# EAGLE design Regbot (EAGLE 9.2.0)
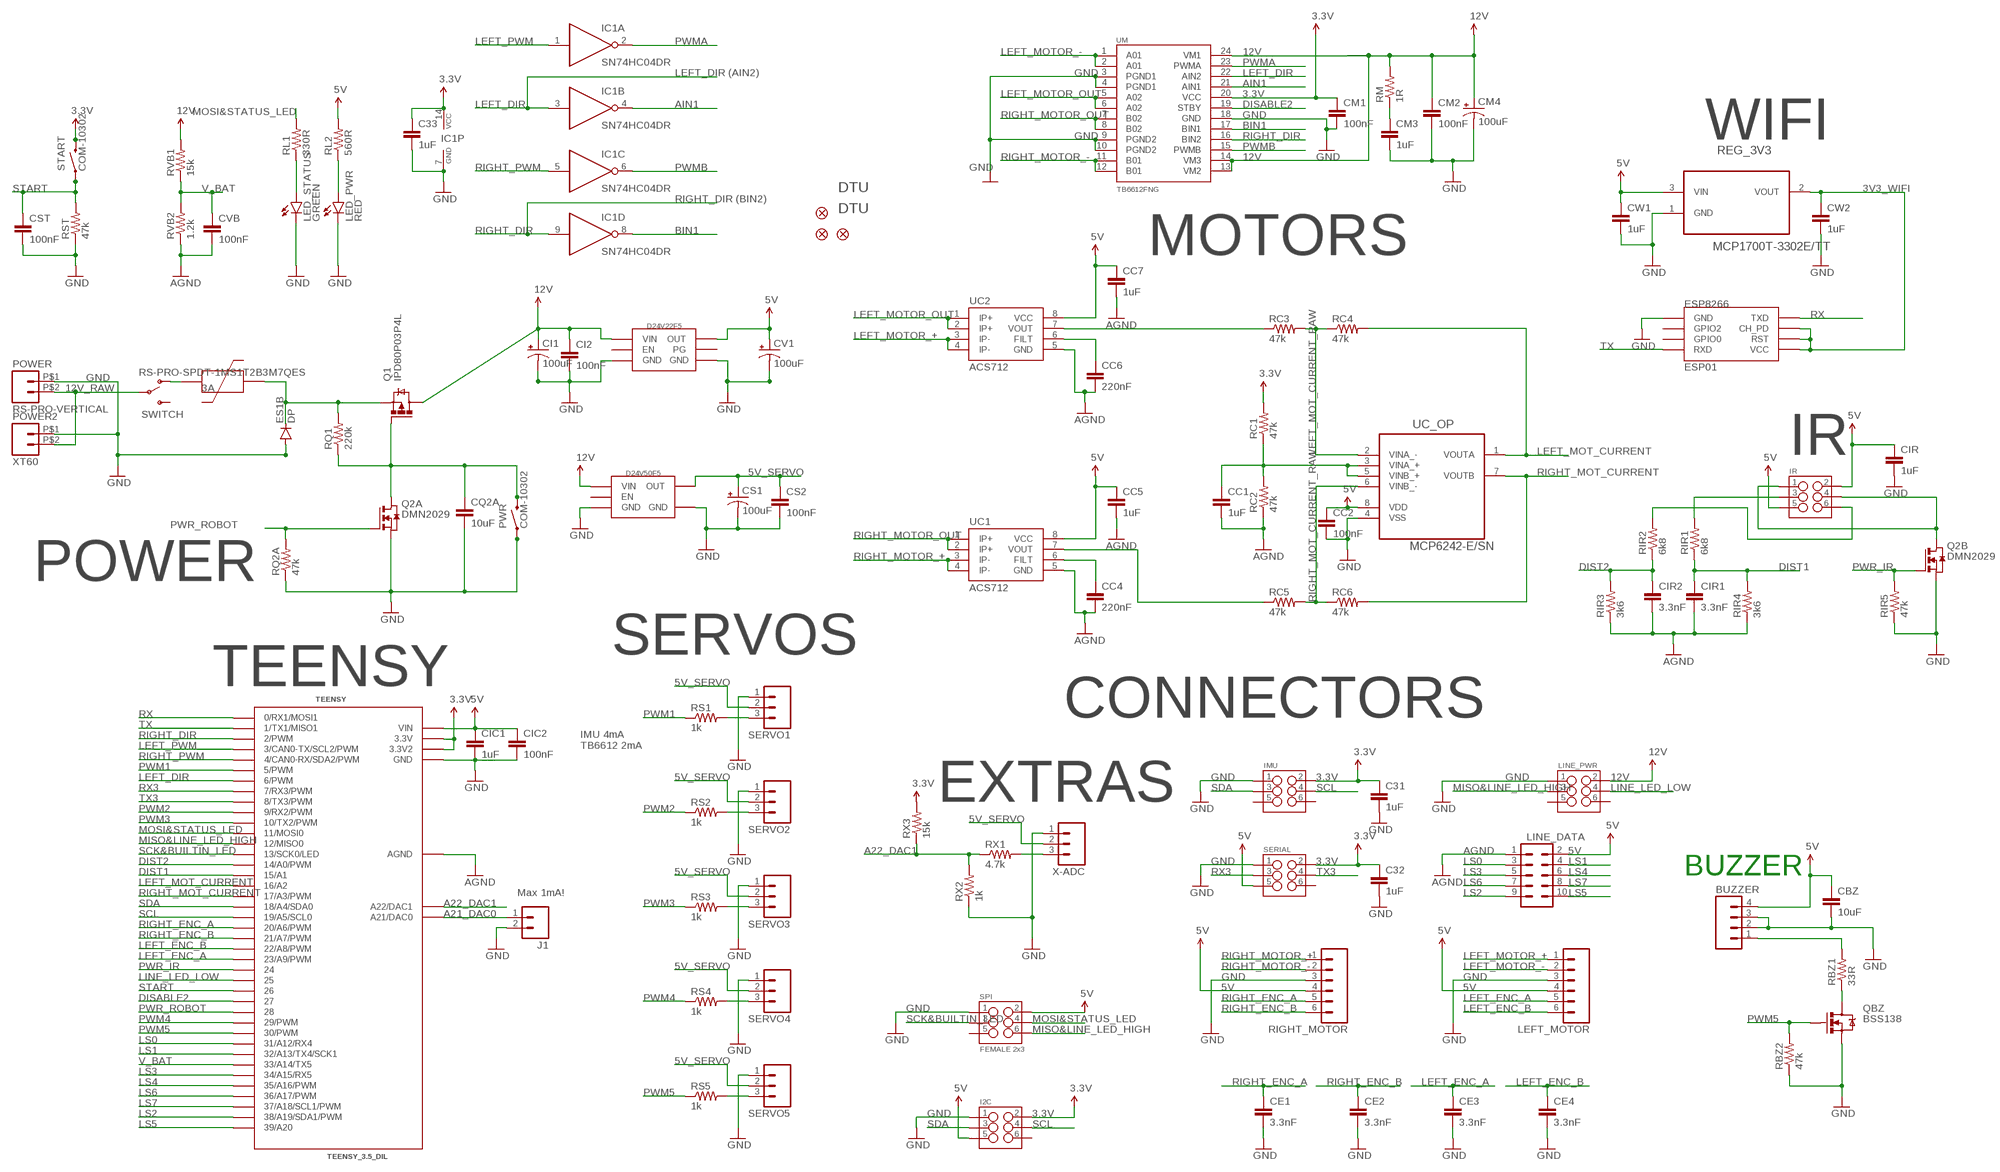
[diagram p0: schematic, sheet 1]

## Parts
BUZZER  M04POLAR  [MOLEX-1X4]
C31  1uF  CAP0805  [0805]
C32  1uF  CAP0805  [0805]
C33  1uF  CAP0805  [0805]
CBZ  10uF  CAP1210  [1210]
CC1  1uF  CAP0805  [0805]
CC2  100nF  CAP0805  [0805]
CC4  220nF  CAP0805  [0805]
CC5  1uF  CAP0805  [0805]
CC6  220nF  CAP0805  [0805]
CC7  1uF  CAP0805  [0805]
CE1  3.3nF  CAP0805  [0805]
CE2  3.3nF  CAP0805  [0805]
CE3  3.3nF  CAP0805  [0805]
CE4  3.3nF  CAP0805  [0805]
CI1  100uF  PANASONIC_D  [PANASONIC_D_XL]
CI2  100nF  CAP0805  [0805]
CIC1  1uF  CAP0805  [0805]
CIC2  100nF  CAP0805  [0805]
CIR  1uF  CAP0805  [0805]
CIR1  3.3nF  CAP0805  [0805]
CIR2  3.3nF  CAP0805  [0805]
CM1  100nF  CAP0805  [0805]
CM2  100nF  CAP0805  [0805]
CM3  1uF  CAP0805  [0805]
CM4  100uF  PANASONIC_D  [PANASONIC_D_XL]
CQ2A  10uF  CAP1210  [1210]
CS1  100uF  PANASONIC_D  [PANASONIC_D_XL]
CS2  100nF  CAP0805  [0805]
CST  100nF  CAP0805  [0805]
CV1  100uF  PANASONIC_D  [PANASONIC_D_XL]
CVB  100nF  CAP0805  [0805]
CW1  1uF  CAP0805  [0805]
CW2  1uF  CAP0805  [0805]
D24V22F5  POLOLU_D24V22  [D24V22]
D24V50F5  POLOLU_D24V50  [D24V50]
DP  ES1B  DIODESMA  [SMA-DIODE]
ESP8266  ESP01  [ESP01]
FD1  FIDUCIAL1X2  [FIDUCIAL-1X2]
FD2  FIDUCIAL1X2  [FIDUCIAL-1X2]
FD3  FIDUCIAL1X2  [FIDUCIAL-1X2]
I2C  M03X2SHROUD  [2X3-SHROUDED]
IC1  SN74HC04DR  74HC04D  [SO14]
IMU  M03X2SHROUD  [2X3-SHROUDED]
IR  M03X2SHROUD  [2X3-SHROUDED]
J1  M02PTH  [1X02]
LED_PWR  RED  LED1206  [LED-1206]
LED_STATUS  GREEN  LED1206  [LED-1206]
LEFT_MOTOR  M06SILK_FEMALE_PTH  [1X06]
LINE_DATA  M05X2SHD  [2X5-SHROUDED]
LINE_PWR  M03X2SHROUD  [2X3-SHROUDED]
MAIN_FUSE  SMF_OMNI-BLOK_FUSE_BLOCK  [SMF_OMNI-BLOK_FUSE_BLOCK]
POWER  RS-PRO-VERTICAL  [RS-PRO-VERTICAL]
POWER2  XT60  [XT60]
PWR  COM-10302  SWITCH-MOMENTARY  [TACTILE-PTH-12MM]
Q1  IPD80P03P4L  IRFR5305  [D-PAK_TO252AA]
Q2  DMN2029  NMOS2SO8  [SO8]
QBZ  BSS138  MOSFET-NCHANNELBSS138  [SOT23]
RBZ1  33R  RESISTOR0805-RES  [0805]
RBZ2  47k  RESISTOR0805-RES  [0805]
RC1  47k  RESISTOR0805-RES  [0805]
RC2  47k  RESISTOR0805-RES  [0805]
RC3  47k  RESISTOR0805-RES  [0805]
RC4  47k  RESISTOR0805-RES  [0805]
RC5  47k  RESISTOR0805-RES  [0805]
RC6  47k  RESISTOR0805-RES  [0805]
REG_3V3  MCP1700T-3302E/TT  [SOT95P237X112-3N]
RIGHT_MOTOR  M06SILK_FEMALE_PTH  [1X06]
RIR1  6k8  RESISTOR0805-RES  [0805]
RIR2  6k8  RESISTOR0805-RES  [0805]
RIR3  3k6  RESISTOR0805-RES  [0805]
RIR4  3k6  RESISTOR0805-RES  [0805]
RIR5  47k  RESISTOR0805-RES  [0805]
RL1  330R  RESISTOR0805-RES  [0805]
RL2  560R  RESISTOR0805-RES  [0805]
RM  1R  RESISTOR0805-RES  [0805]
RQ1  220k  RESISTOR0805-RES  [0805]
RQ2A  47k  RESISTOR0805-RES  [0805]
RS1  1k  RESISTOR0805-RES  [0805]
RS2  1k  RESISTOR0805-RES  [0805]
RS3  1k  RESISTOR0805-RES  [0805]
RS4  1k  RESISTOR0805-RES  [0805]
RS5  1k  RESISTOR0805-RES  [0805]
RST  47k  RESISTOR0805-RES  [0805]
RVB1  15k  RESISTOR0805-RES  [0805]
RVB2  1.2k  RESISTOR0805-RES  [0805]
RX1  4.7k  RESISTOR0805-RES  [0805]
RX2  1k  RESISTOR0805-RES  [0805]
RX3  15k  RESISTOR0805-RES  [0805]
SERIAL  M03X2SHROUD  [2X3-SHROUDED]
SERVO1  M03POLAR  [MOLEX-1X3]
SERVO2  M03POLAR  [MOLEX-1X3]
SERVO3  M03POLAR  [MOLEX-1X3]
SERVO4  M03POLAR  [MOLEX-1X3]
SERVO5  M03POLAR  [MOLEX-1X3]
SPI  FEMALE 2x3  M03X2FEMALE  [2X3]
START  COM-10302  SWITCH-MOMENTARY  [TACTILE-PTH-12MM]
SWITCH  RS-PRO-SPDT-1MS1T2B3M7QES  [RS-PRO-1MS1T2B3M7QES]
TEENSY  TEENSY_3.5_DIL  [TEENSY_3.5_DIL]
U$1  DTUMEDIUM-9MM  [DTU-MEDIUM-9MM]
U$2  DTULARGE  [DTU-LARGE]
UC1  ACS712  [SO08]
UC2  ACS712  [SO08]
UC_OP  MCP6242-E/SN  [SOIC127P600X175-8N]
UM  TB6612FNG  [SSOP24]
X-ADC  M03POLAR  [MOLEX-1X3]

## Nets
3.3V: C31.1 C32.1 C33.1 CM1.1 I2C.2 IC1.14(P:VCC) IMU.2 RC1.2 RX3.2 SERIAL.2 START.3 START.4 TEENSY.3.3V TEENSY.3.3V3(3.3V2) UM.20(VCC)
3V3_WIFI: CW2.1 ESP8266.CH_PD ESP8266.RST ESP8266.VCC REG_3V3.2(VOUT)
5V: BUZZER.4 CBZ.1 CC2.1 CC5.1 CC7.1 CIC1.1 CIC2.1 CIR.1 CV1.+ CW1.1 D24V22F5.P$OUT(OUT) I2C.5 IR.2 IR.5 LEFT_MOTOR.4 LINE_DATA.2 REG_3V3.3(VIN) RIGHT_MOTOR.4 RL2.2 SERIAL.5 SPI.2 TEENSY.VIN UC1.8(VCC) UC2.8(VCC) UC_OP.8(VDD)
5V_SERVO: CS1.+ CS2.1 D24V50F5.P$OUT(OUT) SERVO1.2 SERVO2.2 SERVO3.2 SERVO4.2 SERVO5.2 X-ADC.2
12V: CI1.+ CI2.1 CM2.1 CM4.+ D24V22F5.P$VIN(VIN) D24V50F5.P$VIN(VIN) LINE_PWR.2 Q1.4(D) RM.2 RVB1.2 UM.13(VM2) UM.14(VM3) UM.24(VM1)
12V_RAW: POWER2.P$2 POWER.P$2 SWITCH.P$2(P2)
A21_DAC0: J1.1 TEENSY.A21(A21/DAC0)
A22_DAC1: RX1.1 RX2.2 RX3.1 TEENSY.A22(A22/DAC1)
AGND: CC1.2 CC4.2 CC5.2 CC6.2 CC7.2 CIR1.2 CIR2.2 CVB.2 LINE_DATA.1 RC2.1 RIR3.1 RIR4.1 RVB2.1 TEENSY.AGND UC1.5(GND) UC2.5(GND)
AIN1: IC1.4(B:O) UM.21(AIN1)
BIN1: IC1.8(D:O) UM.17(BIN1)
DISABLE2: TEENSY.27 UM.19(STBY)
DIST1: CIR1.1 RIR1.1 RIR4.2 TEENSY.15/A1
DIST2: CIR2.1 RIR2.1 RIR3.2 TEENSY.14/A0(14/A0/PWM)
GND: BUZZER.2 BUZZER.3 C31.2 C32.2 C33.2 CBZ.2 CC2.2 CE1.2 CE2.2 CE3.2 CE4.2 CI1.- CI2.2 CIC1.2 CIC2.2 CIR.2 CM1.2 CM2.2 CM3.2 CM4.- CQ2A.2 CS1.- CS2.2 CST.2 CV1.- CW1.2 CW2.2 D24V22F5.P$GND1(GND) D24V22F5.P$GND2(GND2) D24V50F5.P$GND2(GND2) D24V50F5.P$GND(GND) DP.A ESP8266.GND I2C.1 IC1.7(P:GND) IMU.1 J1.2 LED_PWR.C LED_STATUS.C LEFT_MOTOR.3 LINE_PWR.1 POWER2.P$1 POWER.P$1 PWR.1 PWR.2 Q2.1(A:S) Q2.3(B:S) QBZ.2(S) RBZ2.1 REG_3V3.1(GND) RIGHT_MOTOR.3 RIR5.1 RQ2A.1 RST.1 RX2.1 SERIAL.1 SERVO1.1 SERVO2.1 SERVO3.1 SERVO4.1 SERVO5.1 SPI.1 TEENSY.GND TEENSY.GND1(GND) UC_OP.4(VSS) UM.3(PGND1) UM.4(PGND1) UM.9(PGND2) UM.10(PGND2) UM.18(GND) X-ADC.1
LEFT_DIR: IC1.3(B:I) TEENSY.6(6/PWM) UM.22(AIN2)
LEFT_ENC_A: CE3.1 LEFT_MOTOR.5 TEENSY.23/A9(23/A9/PWM)
LEFT_ENC_B: CE4.1 LEFT_MOTOR.6 TEENSY.22/A8(22/A8/PWM)
LEFT_MOT_CURRENT: RC4.2 TEENSY.16/A2 UC_OP.1(VOUTA)
LEFT_MOT_CURRENT_RAW: RC3.2 RC4.1 UC_OP.2(VINA_-)
LEFT_MOTOR_+: LEFT_MOTOR.1 UC2.3(IP-) UC2.4(IP-)
LEFT_MOTOR_-: LEFT_MOTOR.2 UM.1(A01) UM.2(A01)
LEFT_MOTOR_OUT: UC2.1(IP+) UC2.2(IP+) UM.5(A02) UM.6(A02)
LEFT_PWM: IC1.1(A:I) TEENSY.3(3/CAN0-TX/SCL2/PWM)
LINE_LED_LOW: LINE_PWR.4 TEENSY.25
LS0: LINE_DATA.3 TEENSY.31/A12(31/A12/RX4)
LS1: LINE_DATA.4 TEENSY.32/A13(32/A13/TX4/SCK1)
LS2: LINE_DATA.9 TEENSY.38/A19(38/A19/SDA1/PWM)
LS3: LINE_DATA.5 TEENSY.34/A15(34/A15/RX5)
LS4: LINE_DATA.6 TEENSY.35/A16(35/A16/PWM)
LS5: LINE_DATA.10 TEENSY.39/A20
LS6: LINE_DATA.7 TEENSY.36/A17(36/A17/PWM)
LS7: LINE_DATA.8 TEENSY.37/A18(37/A18/SCL1/PWM)
MISO&LINE_LED_HIGH: LINE_PWR.3 SPI.6 TEENSY.12(12/MISO0)
MOSI&STATUS_LED: RL1.2 SPI.4 TEENSY.11(11/MOSI0)
N$1: BUZZER.1 RBZ1.2
N$2: QBZ.3(D) RBZ1.1
N$3: LED_STATUS.A RL1.1
N$4: LED_PWR.A RL2.1
N$5: DP.C MAIN_FUSE.PIN1 Q1.3(S) RQ1.2
N$6: MAIN_FUSE.PIN2 SWITCH.P$1(O1)
N$7: CQ2A.1 PWR.3 PWR.4 Q1.1(G) Q2.7(A:D) Q2.8(A:D) RQ1.1
N$8: CM3.1 RM.1
N$9: CC4.1 UC1.6(FILT)
N$10: CC6.1 UC2.6(FILT)
N$11: RC5.1 UC1.7(VOUT)
N$16: CC1.1 RC1.1 RC2.2 UC_OP.3(VINA_+) UC_OP.5(VINB_+)
N$17: RC3.1 UC2.7(VOUT)
N$18: IR.1 IR.4 Q2.5(B:D) Q2.6(B:D)
N$19: RS1.2 SERVO1.3
N$20: IR.3 RIR1.2
N$21: IR.6 RIR2.2
N$22: RS2.2 SERVO2.3
N$23: RS3.2 SERVO3.3
N$24: RS4.2 SERVO4.3
N$25: RS5.2 SERVO5.3
N$26: RX1.2 X-ADC.3
PWM1: RS1.1 TEENSY.5(5/PWM)
PWM2: RS2.1 TEENSY.9(9/RX2/PWM)
PWM3: RS3.1 TEENSY.10(10/TX2/PWM)
PWM4: RS4.1 TEENSY.29(29/PWM)
PWM5: QBZ.1(G) RBZ2.2 RS5.1 TEENSY.30(30/PWM)
PWMA: IC1.2(A:O) UM.23(PWMA)
PWMB: IC1.6(C:O) UM.15(PWMB)
PWR_IR: Q2.4(B:G) RIR5.2 TEENSY.24
PWR_ROBOT: Q2.2(A:G) RQ2A.2 TEENSY.28
RIGHT_DIR: IC1.9(D:I) TEENSY.2(2/PWM) UM.16(BIN2)
RIGHT_ENC_A: CE1.1 RIGHT_MOTOR.5 TEENSY.20/A6(20/A6/PWM)
RIGHT_ENC_B: CE2.1 RIGHT_MOTOR.6 TEENSY.21/A7(21/A7/PWM)
RIGHT_MOT_CURRENT: RC6.2 TEENSY.17/A3(17/A3/PWM) UC_OP.7(VOUTB)
RIGHT_MOT_CURRENT_RAW: RC5.2 RC6.1 UC_OP.6(VINB_-)
RIGHT_MOTOR_+: RIGHT_MOTOR.1 UC1.3(IP-) UC1.4(IP-)
RIGHT_MOTOR_-: RIGHT_MOTOR.2 UM.11(B01) UM.12(B01)
RIGHT_MOTOR_OUT: UC1.1(IP+) UC1.2(IP+) UM.7(B02) UM.8(B02)
RIGHT_PWM: IC1.5(C:I) TEENSY.4(4/CAN0-RX/SDA2/PWM)
RX: ESP8266.TX(TXD) TEENSY.0(0/RX1/MOSI1)
RX3: SERIAL.3 TEENSY.7(7/RX3/PWM)
SCK&BUILTIN_LED: SPI.3 TEENSY.13(13/SCK0/LED)
SCL: I2C.4 IMU.4 TEENSY.19/A5(19/A5/SCL0)
SDA: I2C.3 IMU.3 TEENSY.18/A4(18/A4/SDA0)
START: CST.1 RST.2 START.1 START.2 TEENSY.26
TX: ESP8266.RX(RXD) TEENSY.1(1/TX1/MISO1)
TX3: SERIAL.4 TEENSY.8(8/TX3/PWM)
V_BAT: CVB.1 RVB1.1 RVB2.2 TEENSY.33/A14(33/A14/TX5)
Unconnected: D24V22F5.P$EN(EN) D24V22F5.P$PG(PG) D24V50F5.P$EN(EN) ESP8266.GPIO0 ESP8266.GPIO2 I2C.6 IC1.10(E:O) IC1.11(E:I) IC1.12(F:O) IC1.13(F:I) IMU.5 IMU.6 LINE_PWR.5 LINE_PWR.6 SERIAL.6 SPI.5 SWITCH.P$3(S3)

## Notes on the sheet
- LEFT_DIR (AIN2)
- WIFI
- RIGHT_DIR (BIN2)
- MOTORS
- 3A
- IR
- POWER
- SERVOS
- TEENSY
- CONNECTORS
- IMU 4mA
  TB6612 2mA
- EXTRAS
- BUZZER
- Max 1mA!

## Library data of the parts
BUZZER = SparkFun-Connectors:M04: Header 4 Standard 4-pin 0.1" header. Use with straight break away headers (SKU : PRT-00116), right angle break away headers (PRT-00553), swiss pins (PRT-00743), machine pins (PRT-00117), and female headers (PRT-00115). Molex polarized connector foot print use with SKU : PRT-08231 with associated crimp pins and housings. 1MM SMD Version SKU: PRT-10208
C31 CC1 CC2 CC4-CC7 CE1-CE4 CI2 CIC2 CIR CIR1 CIR2 CM1-CM3 CS2 CST CVB CW1 CW2 = SparkFun-Passives:CAP: Capacitor Standard 0603 ceramic capacitor, and 0.1" leaded capacitor.
C32 C33 CBZ CIC1 CQ2A = SparkFun-Capacitors:CAP: Capacitor Standard 0603 ceramic capacitor, and 0.1" leaded capacitor.
CI1 CM4 CS1 CV1 = PanasonicCapacitors:PANASONIC_D
D24V22F5 = Pololu:POLOLU_D24V22
D24V50F5 = Pololu:POLOLU_D24V50
DP = SparkFun-DiscreteSemi:DIODE: Diode These are standard reverse protection diodes and small signal diodes. SMA package can handle up to about 1A. SOD-323 can handle about 200mA. What the SOD-323 package when ordering, there are some mfgs out there that are 5-pin packages.
ESP8266 = esp8266modules:ESP01: ESP8266 Wifi module 01
FD1-FD3 = SparkFun-Aesthetics:FIDUCIAL: Fiducial Alignment Points Various fiducial points for machine vision alignment.
I2C IMU IR LINE_PWR SERIAL = SparkFun-Connectors:M03X2: 2x3 .1" header. Shrouded, with keying- CONN-10681 SMT- CONN-11415 Pogo pins- HW-11044; PROD_ID: CONN-10681; RS: 832-3496
IC1 = 74xx-eu:74*04: Hex INVERTER
J1 = SparkFun-Connectors:M02: Standard 2-pin 0.1" header. Use with - straight break away headers ( PRT-00116) - right angle break away headers (PRT-00553) - swiss pins (PRT-00743) - machine pins (PRT-00117) - female headers (PRT-00115) Molex polarized connector foot print use with: PRT-08233 with associated crimp pins and housings. 2.54_SCREWTERM for use with PRT-10571. 3.5mm Screw Terminal footprints for PRT-08084 5mm Screw Terminal footprints for use with PRT-08432
LED_PWR LED_STATUS = SparkFun-LED:LED: LEDs Standard schematic elements and footprints for 5mm, 3mm, 1206, and 0603 sized LEDs. 5mm - Spark Fun Electronics SKU : COM-00529 (and others)
LEFT_MOTOR RIGHT_MOTOR = SparkFun-Connectors:M06: Header 6 Standard 6-pin 0.1" header. Use with straight break away headers (SKU : PRT-00116), right angle break away headers (PRT-00553), swiss pins (PRT-00743), machine pins (PRT-00117), and female headers (PRT-00115). Molex polarized connector foot print use with SKU : PRT-08094 with associated crimp pins and housings. NOTES ON THE VARIANTS LOCK and LOCK_LONGPADS... This footprint was designed to help hold the alignment of a through-hole component (i.e. 6-pin header) while soldering it into place. You may notice that each hole has been shifted either up or down by 0.005 of an inch from it's more standard position (which is a perfectly straight line). This slight alteration caused the pins (the squares in the middle) to touch the edges of the holes. Because they are alternating, it causes a "brace" to hold the component in place. 0.005 has proven to be the perfect amount of "off-center" position when using our standard breakaway headers. Although looks a little odd when you look at the bare footprint, once you have a header in there, the alteration is very hard to notice. Also,if you push a header all the way into place, it is covered up entirely on the bottom side. This idea of altering the position of holes to aid alignment will be further integrated into the Sparkfun Library for other footprints. It can help hold any component with 3 or more connection pins.; PROD_ID: CONN-08437
LINE_DATA = SparkFun-Connectors:M05X2: Header 5x2 Standard 10-pin dual row 0.1" header. Commonly used with AVR-ISP. Use with Spark Fun Electronics SKU: PRT-00778; RS: 832-3528
MAIN_FUSE = SMF_OMNI-BLOK_FUSE_BLOCK:SMF_OMNI-BLOK_FUSE_BLOCK
POWER = BlockSocket:RS-PRO-VERTICAL; OC_NEWARK: unknown; PURPOSE: DYSE
POWER2 = XT60:XT60
PWR START = Buttons:SWITCH-MOMENTARY
Q1 = transistor-power:IRF?5305: HEXFET Power MOSFET Source: http://www.irf.com/product-info/datasheets/data/irfr5305pbf.pdf; RS: 110-7433
Q2 = zetex:NMOS2: Dual MOS FET; OC_FARNELL: unknown; OC_NEWARK: unknown
QBZ = SparkFun-DiscreteSemi:MOSFET-NCHANNEL: Common NMOSFET Parts MFG P/N Store ID Prod ID FDD8780 TRANS-09984 SI7820DN TRANS-11055 FDS6630A IC-08089 2N7002PW TRANS-11151 FQP30N06L COM-10213 TRANS-10060 BSS123LT1G TRANS-08345 BSS138 TRANS-00830 BS170 2N7000; PROD_ID: TRANS-00830
RBZ1 RBZ2 RC1-RC6 RIR1-RIR5 RL1 RL2 RM RQ1 RQ2A RS1-RS5 RST RVB1 RVB2 RX1-RX3 = SparkFun-Resistors:RESISTOR: Resistor Basic schematic elements and footprints for 0603, 1206, and PTH resistors.
REG_3V3 = Microchip_By_element14_Batch_1:MCP1700T-3302E/TT: Low Quiescent Current LDO; MPN: MCP1700T-3302E/TT; OC_FARNELL: 1296592; OC_NEWARK: 88H9817; PACKAGE: SOT23-3; SUPPLIER: Microchip
SERVO1-SERVO5 X-ADC = SparkFun-Connectors:M03: Header 3 Standard 3-pin 0.1" header. Use with straight break away headers (SKU : PRT-00116), right angle break away headers (PRT-00553), swiss pins (PRT-00743), machine pins (PRT-00117), and female headers (PRT-00115). Molex polarized connector foot print use with SKU : PRT-08232 with associated crimp pins and housings.
SPI = SparkFun-Connectors:M03X2: 2x3 .1" header. Shrouded, with keying- CONN-10681 SMT- CONN-11415 Pogo pins- HW-11044; PROD_ID: CONN-11566
SWITCH = Rocker-Switch-2:RS-PRO-SPDT-1MS1T2B3M7QES; RS: 734-7094
TEENSY = Teensy_3_and_LC_Series_Boards_v1.4:TEENSY_3.5_DIL: DIL version of the Teensy 3.5
U$1 U$2 = Logos:DTU
UC1 UC2 = SparkFun-AnalogIC:ACS712: Hall-effect-based isolated linear current sensor; PROD_ID: IC-08964
UC_OP = Microchip_By_element14_Batch_1:MCP6242-E/SN: OP AMP, 1.8V, 200KHZ, DUAL; MPN: MCP6242-E/SN; OC_FARNELL: 1439446; OC_NEWARK: 58M8960; PACKAGE: SOIC 8; SUPPLIER: Microchip
UM = SparkFun-PowerIC:TB6612FNG: Toshiba 1A dual motor driver IC-09363; PROD_ID: IC-09363

## Board
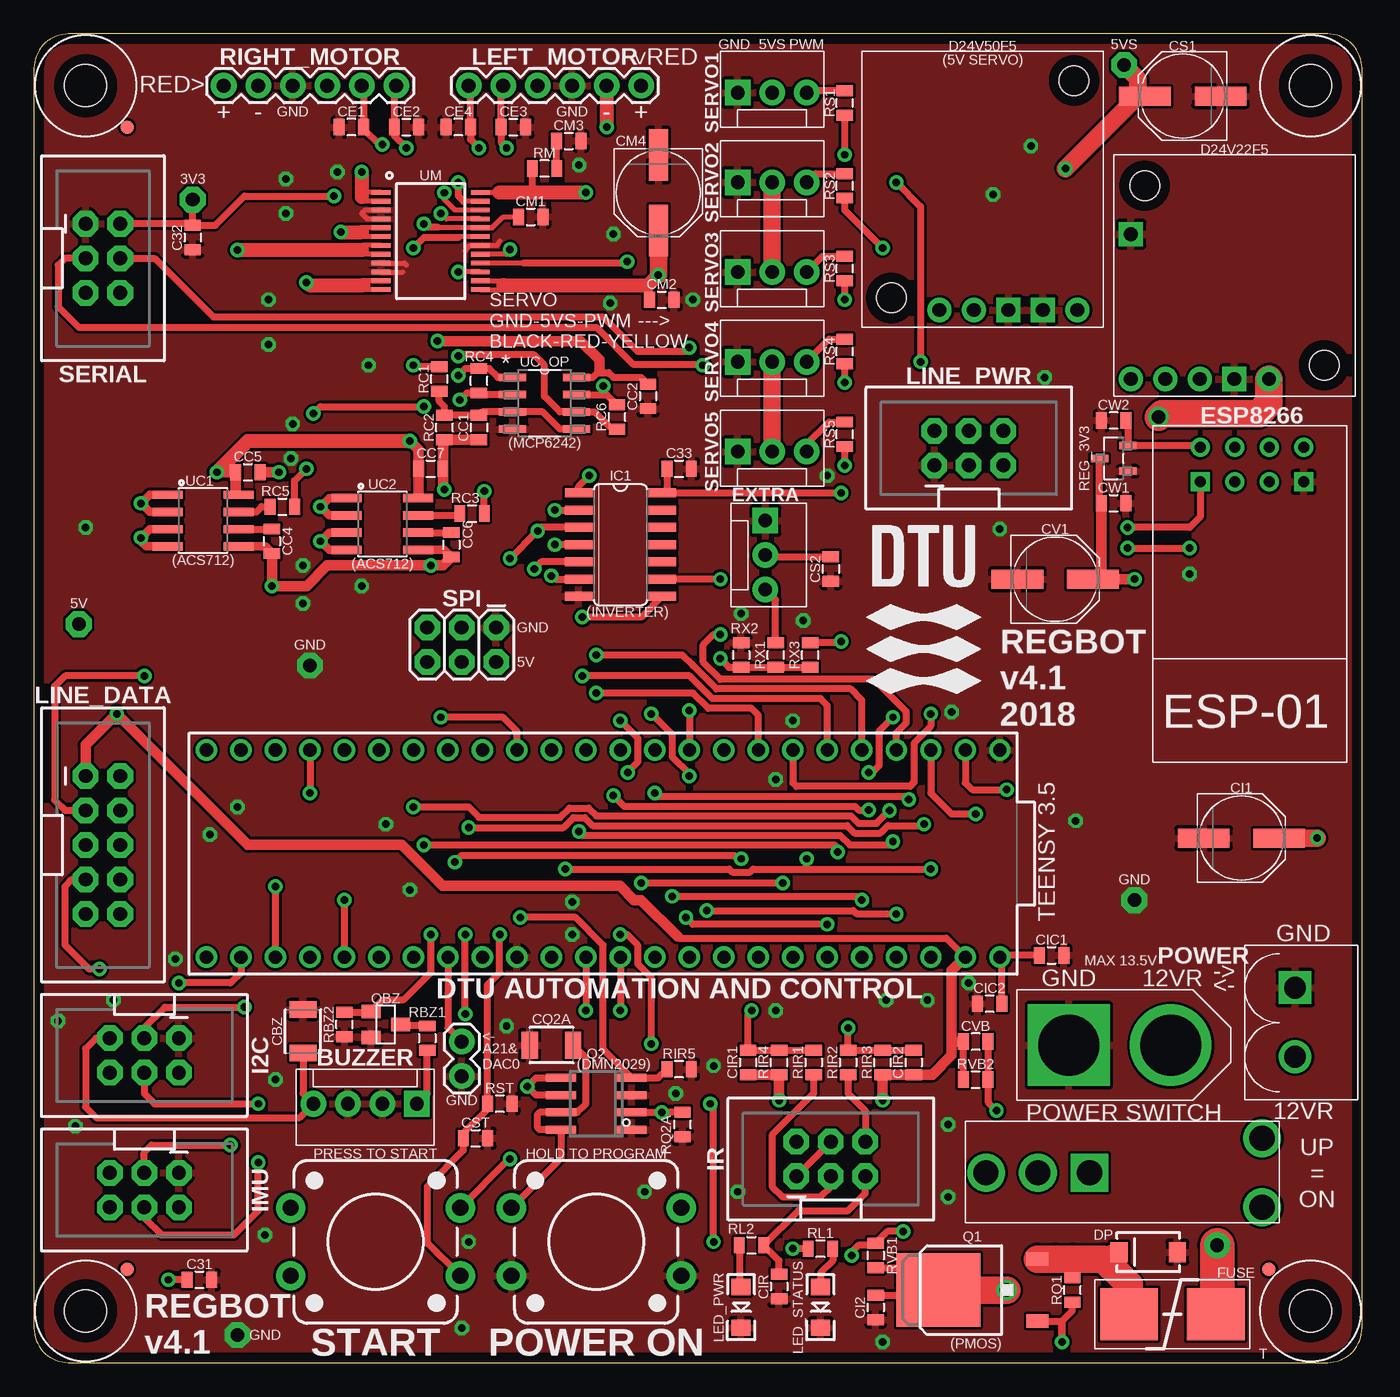
[diagram p1: board, top side]
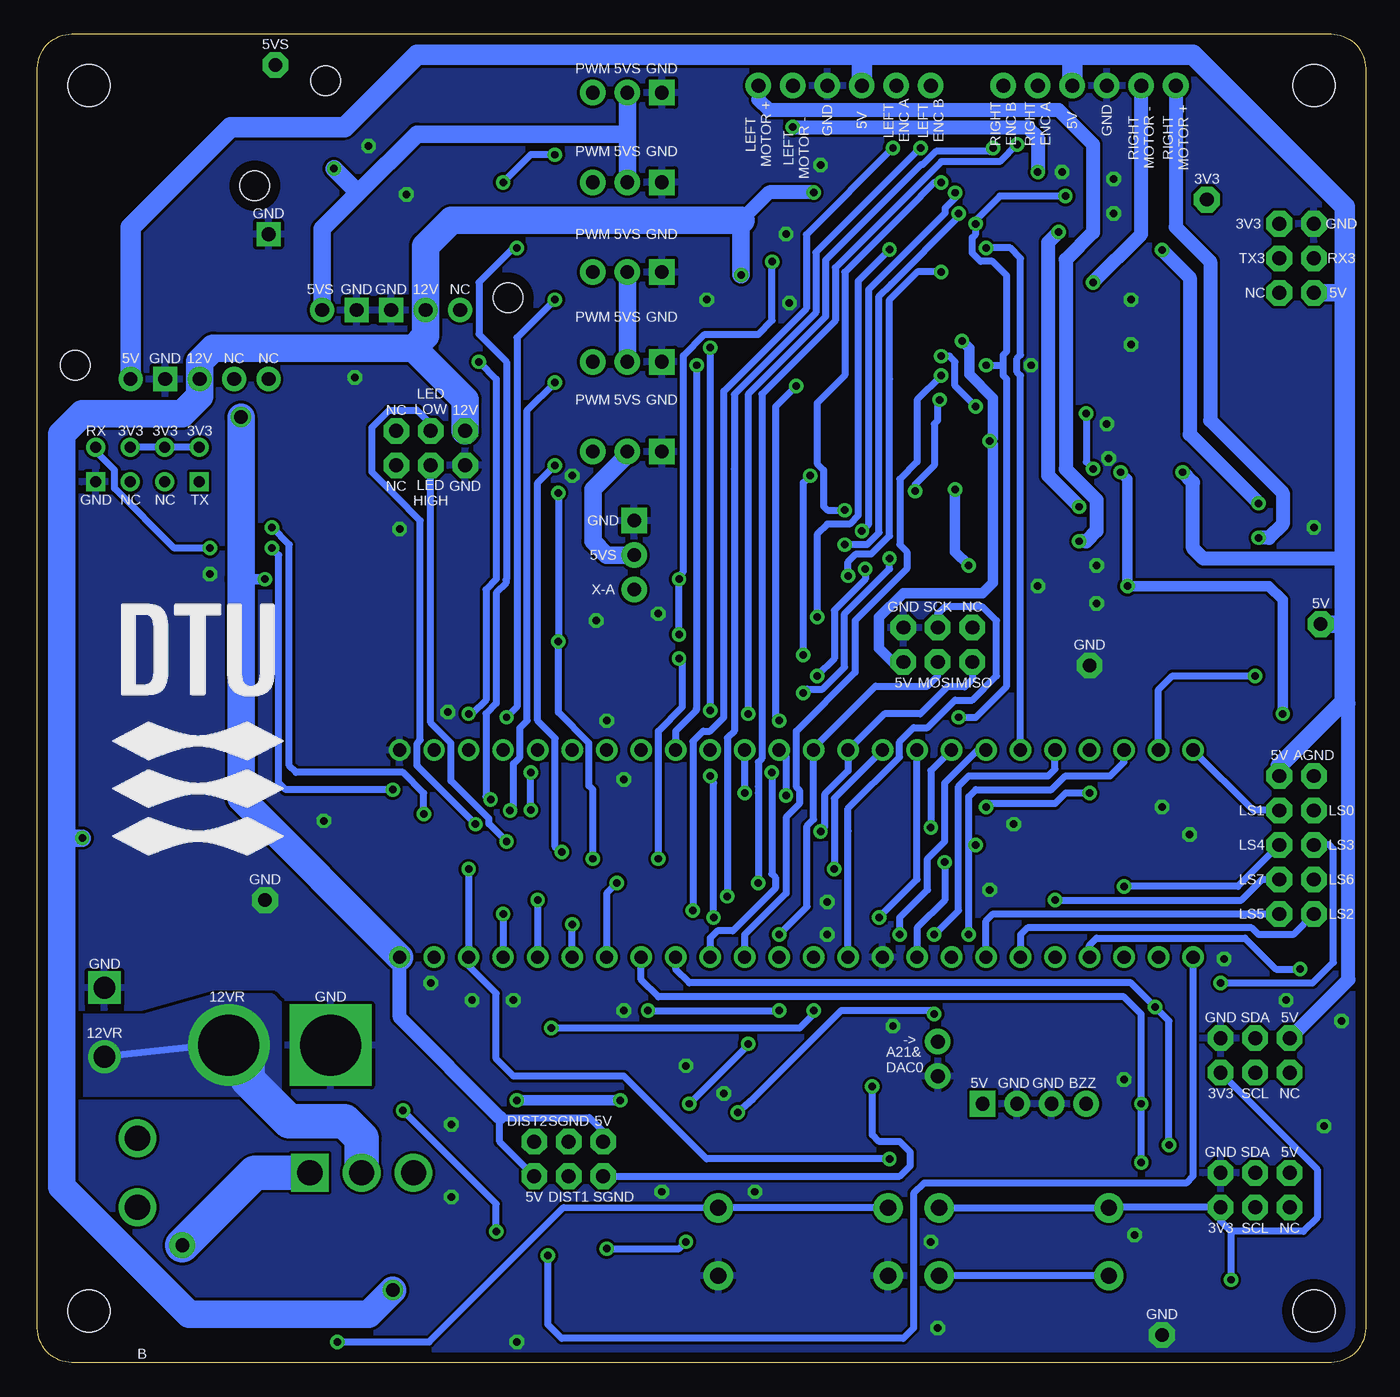
[diagram p2: board, bottom side, seen from below]

Size 97.79 x 97.79 mm. Coordinates in mm from the lower left corner, seen from the top.
Outline: 2.54,0 95.25,0 arc90 97.79,2.54 97.79,95.25 arc90 95.25,97.79 2.54,97.79 arc90 0,95.25 0,2.54 arc90 2.54,0
Copper layers (1*16): Top 0.035mm / dielectric 1.5mm / Bottom 0.035mm
Design rules "CustomSparkFun2Layer *": minimum track width 13mil, minimum drill 20mil, track to track 8mil, track to pad 8mil, pad to pad 8mil, via to via 8mil, smd to smd 8mil, copper to edge 30mil, drill to drill 8mil, minimum pad ring 12mil, minimum via ring 10mil, stop-mask expansion 4mil, vias tented up to drill 25mil, thermal gap 10mil
Holes 3.1 mm at 3.81,3.81 93.98,3.81 93.98,93.98 3.81,93.98

### Footprints (pad centres in the part's own frame; a part is rotated, then mirrored left to right if it is on the bottom)
MOLEX-1X4 = drill 1.016 pad 1.88 square: 1 0,0 | drill 1.016 pad 1.88: 2 2.54,0; 3 5.08,0; 4 7.62,0
0805 = smd 0.8 x 1.2: 1 -0.9,0; 2 0.9,0
1210 = smd 1.2 x 2: 1 -1.6,0; 2 1.6,0
PANASONIC_D_XL = smd 3.813 x 1.4: + 2.781,0; - -2.781,0
D24V22 = drill 1.016 pad 1.778: P$EN 3.81,1.27; P$OUT 11.43,1.27; P$PG 1.27,1.27; P$VIN 6.35,1.27 | drill 1.016 pad 1.778 square: P$GND1 1.27,11.938; P$GND2 8.89,1.27 | hole 2.184: 15.494,2.286; 2.286,15.494
D24V50 = drill 1.016 pad 1.778: P$EN -3.175,-8.89; P$OUT 6.985,-8.89; P$VIN -0.635,-8.89 | drill 1.016 pad 1.778 square: P$GND 1.905,-8.89; P$GND2 4.445,-8.89 | hole 2.184: -6.731,-8.001; 6.731,8.001
SMA-DIODE = smd 1.27 x 1.47: A -2.15,0; C 2.15,0
ESP01 = drill 0.8: CH_PD -1.285,-8.178; GPIO0 1.255,-5.638; GPIO2 -1.285,-5.638; RST 1.255,-8.178; TX -3.825,-8.178; VCC 3.795,-8.178 | drill 0.8 square: GND -3.825,-5.638; RX 3.795,-5.638
FIDUCIAL-1X2 = smd 1 x 1: 1 0,0
2X3-SHROUDED = drill 1.016 pad 1.88 octagon: 1 -1.27,2.54; 2 1.27,2.54; 3 -1.27,0; 4 1.27,0; 5 -1.27,-2.54; 6 1.27,-2.54
SO14 = smd 0.66 x 2.032: 1 -3.81,-3.073; 2 -2.54,-3.073; 3 -1.27,-3.073; 4 0,-3.073; 5 1.27,-3.073; 6 2.54,-3.073; 7 3.81,-3.073; 8 3.81,3.073; 9 2.54,3.073; 10 1.27,3.073; 11 0,3.073; 12 -1.27,3.073; 13 -2.54,3.073; 14 -3.81,3.073
1X02 = drill 1.016 pad 1.88: 1 0,0; 2 2.54,0
LED-1206 = smd 1.2 x 1.4: A -1.5,0; C 1.5,0
1X06 = drill 1.016 pad 1.88: 1 0,0; 2 2.54,0; 3 5.08,0; 4 7.62,0; 5 10.16,0; 6 12.7,0
2X5-SHROUDED = drill 1.016 pad 1.88 octagon: 1 -1.27,5.08; 2 1.27,5.08; 3 -1.27,2.54; 4 1.27,2.54; 5 -1.27,0; 6 1.27,0; 7 -1.27,-2.54; 8 1.27,-2.54; 9 -1.27,-5.08; 10 1.27,-5.08
SMF_OMNI-BLOK_FUSE_BLOCK = smd 4.242 x 3.81: PIN1 -3.175,0; PIN2 3.2,0
RS-PRO-VERTICAL = drill 1.6 square: P$1 3.14,3.7 | drill 1.6: P$2 8.22,3.7
XT60 = drill 4.5 pad 6 square: P$1 0,-3.81 | drill 4.5 pad 6: P$2 0,3.69
TACTILE-PTH-12MM = drill 1.2 pad 2.159: 1 6.25,-2.5; 2 -6.25,-2.5; 3 6.25,2.5; 4 -6.25,2.5
D-PAK_TO252AA = smd 1 x 1.6: 1 -2.28,-4.8; 3 2.28,-4.8 | smd 5.4 x 6.2: 4 0,2.5
SO8 = smd 0.6 x 2.2: 1 -1.905,-2.6; 2 -0.635,-2.6; 3 0.635,-2.6; 4 1.905,-2.6; 5 1.905,2.6; 6 0.635,2.6; 7 -0.635,2.6; 8 -1.905,2.6
SOT23 = smd 1 x 1.4: 1 -0.95,-1.1; 2 0.95,-1.1; 3 0,1.1
SOT95P237X112-3N = smd 0.559 x 1.27: 1 -0.94,-1.041; 2 0.94,-1.041; 3 0,1.041
MOLEX-1X3 = drill 1.016 pad 1.88 square: 1 0,0 | drill 1.016 pad 1.88: 2 2.54,0; 3 5.08,0
2X3 = drill 1.016 pad 1.88 octagon: 1 0,0; 2 0,2.54; 3 2.54,0; 4 2.54,2.54; 5 5.08,0; 6 5.08,2.54
RS-PRO-1MS1T2B3M7QES = drill 1.85 square: P$1 0,0 | drill 1.85: P$2 0,3.81; P$3 0,7.62; P$4 -2.54,-12.7; P$5 2.54,-12.7
TEENSY_3.5_DIL = drill 0.965: 0 -7.62,26.67; 1 -7.62,24.13; 2 -7.62,21.59; 3 -7.62,19.05; 3.3V 7.62,24.13; 3.3V3 -7.62,-6.35; 4 -7.62,16.51; 5 -7.62,13.97; 6 -7.62,11.43; 7 -7.62,8.89; 8 -7.62,6.35; 9 -7.62,3.81; 10 -7.62,1.27; 11 -7.62,-1.27; 12 -7.62,-3.81; 13 7.62,-3.81; 14/A0 7.62,-1.27; 15/A1 7.62,1.27; 16/A2 7.62,3.81; 17/A3 7.62,6.35; 18/A4 7.62,8.89; 19/A5 7.62,11.43; 20/A6 7.62,13.97; 21/A7 7.62,16.51; 22/A8 7.62,19.05; 23/A9 7.62,21.59; 24 -7.62,-8.89; 25 -7.62,-11.43; 26 -7.62,-13.97; 27 -7.62,-16.51; 28 -7.62,-19.05; 29 -7.62,-21.59; 30 -7.62,-24.13; 31/A12 -7.62,-26.67; 32/A13 -7.62,-29.21; 33/A14 7.62,-29.21; 34/A15 7.62,-26.67; 35/A16 7.62,-24.13; 36/A17 7.62,-21.59; 37/A18 7.62,-19.05; 38/A19 7.62,-16.51; 39/A20 7.62,-13.97; A21 7.62,-11.43; A22 7.62,-8.89; AGND 7.62,26.67; GND -7.62,29.21; GND1 7.62,-6.35; VIN 7.62,29.21
SO08 = smd 0.61 x 2.21: 1 -1.905,-2.616; 2 -0.635,-2.616; 3 0.635,-2.616; 4 1.905,-2.616; 5 1.905,2.616; 6 0.635,2.616; 7 -0.635,2.616; 8 -1.905,2.616
SOIC127P600X175-8N = smd 1.981 x 0.559: 1 -2.362,1.905; 2 -2.362,0.635; 3 -2.362,-0.635; 4 -2.362,-1.905; 5 2.362,-1.905; 6 2.362,-0.635; 7 2.362,0.635; 8 2.362,1.905
SSOP24 = smd 0.348 x 1.397: 1 -3.575,-3.656; 2 -2.925,-3.656; 3 -2.275,-3.656; 4 -1.625,-3.656; 5 -0.975,-3.656; 6 -0.325,-3.656; 7 0.325,-3.656; 8 0.975,-3.656; 9 1.625,-3.656; 10 2.275,-3.656; 11 2.925,-3.656; 12 3.575,-3.656; 13 3.575,3.656; 14 2.925,3.656; 15 2.275,3.656; 16 1.625,3.656; 17 0.975,3.656; 18 0.325,3.656; 19 -0.325,3.656; 20 -0.975,3.656; 21 -1.625,3.656; 22 -2.275,3.656; 23 -2.925,3.656; 24 -3.575,3.656

### Placement (x,y rotation side)
BUZZER  28.19,19.05 180 top
C31  12.19,6.1 0 top
C32  11.68,82.8 270 top
C33  47.5,65.79 0 top
CBZ  19.81,24.38 90 top
CC1  32.77,68.83 270 top
CC2  45.21,71.12 270 top
CC4  17.53,60.45 270 top
CC5  15.75,65.53 0 top
CC6  30.73,60.2 270 top
CC7  29.21,65.79 0 top
CE1  23.37,90.93 180 top
CE2  27.43,90.93 0 top
CE3  35.31,90.93 0 top
CE4  31.24,90.93 180 top
CI1  88.9,38.61 0 top
CI2  61.98,4.06 270 top
CIC1  74.93,29.97 0 top
CIC2  70.36,26.42 180 top
CIR  54.86,5.59 270 top
CIR1  52.58,22.1 270 top
CIR2  64.77,22.1 270 top
CM1  36.58,84.33 0 top
CM2  46.23,78.23 0 top
CM3  39.37,89.92 0 top
CM4  45.97,86.11 270 top
CQ2A  38.1,23.37 180 top
CS1  84.58,93.22 180 top
CS2  58.67,58.42 270 top
CST  32.51,16.51 0 top
CV1  75.18,57.66 0 top
CVB  69.34,23.62 180 top
CW1  79.5,63.25 0 top
CW2  79.5,69.34 180 top
D24V22F5  79.5,71.12 0 top
D24V50F5  69.85,86.36 0 top
DP  82.04,8.13 180 top
ESP8266  89.66,59.18 180 top
FD1  6.86,6.86 0 top
FD2  6.86,90.93 0 top
FD3  90.93,6.86 0 top
I2C  8.13,22.61 270 top
IC1  43.18,60.2 270 top
IMU  8.13,12.7 270 top
IR  58.67,14.99 90 top
J1  31.5,23.62 270 top
LED_PWR  52.07,4.06 270 top
LED_STATUS  57.91,4.06 270 top
LEFT_MOTOR  44.7,93.98 180 top
LINE_DATA  5.08,38.1 0 top
LINE_PWR  68.83,67.31 90 top
MAIN_FUSE  83.82,3.56 0 top
POWER  89.15,30.73 270 top
POWER2  80.01,23.37 270 top
PWR  41.4,8.89 0 top
Q1  69.09,5.33 90 top
Q2  41.4,19.05 90 top
QBZ  25.91,24.89 270 top
RBZ1  28.96,23.88 270 top
RBZ2  22.86,24.89 90 top
RC1  29.84,72.39 90 top
RC2  30.23,68.83 90 top
RC3  32.26,62.48 0 top
RC4  32.77,72.26 90 top
RC5  18.29,62.99 0 top
RC6  42.93,69.6 90 top
REG_3V3  79.5,66.55 90 top
RIGHT_MOTOR  13.97,93.98 0 top
RIR1  57.4,22.1 270 top
RIR2  59.94,22.1 270 top
RIR3  62.48,22.1 90 top
RIR4  54.86,22.1 90 top
RIR5  47.5,21.59 180 top
RL1  57.91,8.38 180 top
RL2  52.83,8.64 0 top
RM  37.59,87.88 180 top
RQ1  76.45,5.33 90 top
RQ2A  47.75,17.53 90 top
RS1  59.69,92.71 90 top
RS2  59.69,86.61 90 top
RS3  59.69,80.52 90 top
RS4  59.69,74.42 90 top
RS5  59.69,68.33 90 top
RST  34.29,19.05 180 top
RVB1  61.98,7.87 270 top
RVB2  69.34,20.83 0 top
RX1  54.61,52.07 90 top
RX2  52.07,52.07 270 top
RX3  57.15,52.07 90 top
SERIAL  5.08,81.28 0 top
SERVO1  51.82,93.47 0 top
SERVO2  51.82,86.87 0 top
SERVO3  51.82,80.26 0 top
SERVO4  51.82,73.66 0 top
SERVO5  51.82,67.06 0 top
SPI  34.04,54.1 180 top
START  25.15,8.89 0 top
SWITCH  77.72,13.97 90 top
TEENSY  41.91,37.47 270 top
U$1  65.53,56.13 0 top
U$2  85.85,47.75 0 bottom
UC1  12.45,61.98 270 top
UC2  25.65,61.72 270 top
UC_OP  37.59,70.61 0 top
UM  29.21,82.55 270 top
X-ADC  53.85,61.98 270 top

### Tracks (layer width: path | path; a pad name or v marks a point on that pad's centre or on a via)
3.3V  (via drill 0.55, 1 pad 1.91)
  Top 0.356: 29.72,83.57 29.76,83.53 UM.20 33.74,83.53 34.54,84.33 CM1.1
  Top 0.508: START.3 34.99,14.99 v35.05,14.99 | C32.1 11.57,83.82 SERIAL.2 | v39.12,36.32 51.18,36.32 51.41,36.1 52.73,36.1 52.96,36.32 56.9,36.32 | 56.9,36.32 v66.04,36.32 | v29.97,47.5 34.54,47.5 35.56,46.48 TEENSY.3.3V3 | RC1.2 28.06,73.29 v27.94,73.41 | v28.7,83.82 28.96,83.57 29.72,83.57 | v22.1,85.85 15.49,85.85 13.35,83.7 C32.1 | 56.9,36.32 v56.9,37.08 | v59.44,53.09 59.32,52.97 RX3.2 | IC1.14 46.48,64.01 | 46.48,64.01 v59.44,64.01 | C31.1 v9.91,6.1 | C32.1 v11.68,85.6 | C33.1 46.6,64.12 46.48,64.01
  Bottom 0.508: START.3 START.4 18.86,11.43 IMU.2 10.67,10.41 9.91,9.65 | I2C.2 3.56,14.22 3.56,10.67 4.57,9.65 9.91,9.65 | v35.05,14.99 48.51,14.99 54.61,21.08 62.74,21.08 64.01,22.35 64.01,27.18 66.04,29.21 TEENSY.3.3V v66.04,36.32 | 9.91,9.65 v9.91,6.1 | TEENSY.3.3V3 39.12,41.53 v39.12,36.32 | v29.97,47.5 28.7,47.5 26.42,49.78 26.42,72.39 26.67,72.64 26.67,73.41 | v27.94,73.41 26.67,73.41 | 26.67,73.41 26.67,74.17 26.42,74.42 26.42,80.01 27.46,81.06 28.35,81.06 28.96,81.66 28.96,82.8 28.7,83.06 v28.7,83.82 28.7,84.07 26.92,85.85 v22.1,85.85 | v56.9,37.08 56.9,42.16 57.17,42.44 57.17,45.6 59.44,47.86 v59.44,53.09 v59.44,64.01
3V3_WIFI
  Top 0.508: ESP8266.VCC 85.74,67.49 REG_3V3.2 80.54,69.2 CW2.1
  Bottom 0.508: ESP8266.VCC ESP8266.RST ESP8266.CH_PD
5V  (via drill 0.55, 1, 1 pad 1.91)
  Top 0.508: CW1.1 78.46,63.64 REG_3V3.3 | IR.5 61.21,12.45 59.94,11.18 56.27,11.18 RL2.2 54.86,7.5 CIR.1 | CC7.1 28.19,65.9 | UC_OP.8 41.15,72.52 41.5,72.87 | 41.5,72.87 41.91,72.87 42.32,72.87 42.67,72.52 44.72,72.52 CC2.1 | I2C.5 4.57,23.88 3.81,23.11 3.81,18.8 4.57,18.03 19.56,18.03 BUZZER.4 19.81,19.81 CBZ.1 | 41.63,72.99 41.5,72.87 | UC2.8 28.31,63.67 28.31,63.87 | 14.85,64.09 UC1.8 | CIC2.1 71.26,29.71 TEENSY.VIN 71.25,29.97 CIC1.1
  Top 0.762: CV1.+ 78.49,57.66 | 78.49,57.66 v81.03,57.66 | CW1.1 78.6,57.52 78.49,57.66 | v13.46,65.53 CC5.1 14.85,64.09 | v29.72,75.18 40.26,75.18 41.63,73.81 41.63,72.99 | v27.69,67.82 28.31,67.19 CC7.1 28.31,63.87
  Top 1.016: v27.69,67.82 15.75,67.82 v13.46,65.53
  Top 2.032: D24V22F5.P$OUT 90.93,70.61 90.17,69.85 83.06,69.85 v82.8,69.6
  Bottom 0.508: IR.2 56.13,17.02 57.15,18.03 63.75,18.03 63.75,16.26 IR.5
  Bottom 0.762: v81.03,57.66 82.8,57.66 | SPI.2 34.8,51.56 35.81,52.58 35.81,54.86 34.04,56.64 28.19,56.64 27.43,57.4 27.43,67.56 v27.69,67.82 27.43,68.07 27.43,71 29.18,72.74 29.18,74.65 v29.72,75.18
  Bottom 1.016: 63.75,18.03 71.12,25.4 TEENSY.VIN | I2C.5 1.27,28.19 1.27,48.51 1.52,48.77 | 1.52,59.18 11.94,59.18 12.7,59.94 12.7,64.77 v13.46,65.53
  Bottom 1.27: LINE_DATA.2 6.35,43.94 1.52,48.77 | 3.05,78.74 SERIAL.5 1.52,78.74 | 21.59,96.01 21.84,96.27 | 1.52,54.36 v3.3,54.36
  Bottom 1.524: D24V22F5.P$OUT 90.93,83.57 83.57,90.93 75.18,90.93 69.85,96.27 37.08,96.27 | 37.08,96.27 21.84,96.27 12.7,96.27 1.52,85.09 1.52,78.74 1.52,59.18 1.52,54.36 1.52,48.77 | RIGHT_MOTOR.4 21.59,96.01 | LEFT_MOTOR.4 37.08,96.27
  Bottom 2.032: v82.8,69.6 82.8,57.66 82.8,41.53 TEENSY.VIN
5V_SERVO  (via drill 0.55, 1 pad 1.91)
  Top 0.508: 54.24,69.23 SERVO5.2 | CS1.+ 81.28,93.74 | X-ADC.2 53.96,59.32 CS2.1
  Top 1.27: SERVO5.2 SERVO4.2 | SERVO3.2 SERVO2.2 | CS1.+ 81.28,93.22 v75.95,87.88 | 81.28,93.74 81.28,94.49 v80.26,95.5
  Bottom 1.27: X-ADC.2 55.88,59.44 56.9,60.45 56.9,64.26 54.36,66.8 SERVO5.2 | SERVO4.2 SERVO3.2 | SERVO2.2 54.36,90.68 | 54.36,90.68 SERVO1.2 | D24V50F5.P$OUT 76.83,83.44 74.17,86.11 | 74.17,86.11 69.85,90.42 54.61,90.42 54.36,90.68 | 74.17,86.11 v75.95,87.88
12V  (via drill 0.55, 1)
  Top 0.356: UM.24 34.27,86.12 | UM.14 34.55,79.62 34.54,79.3 34.52,78.97 UM.13
  Top 0.508: 66.2,4.94 Q1.4 | CI2.1 66.22,4.96 Q1.4 | RVB1.2 67.19,6.97 67.31,6.86 67.31,6.06 Q1.4 | CM2.1 45.33,79.39 45.21,79.3 | 36.93,86.26 36.69,86.25 | RM.2 36.69,86.25 | 36.69,86.25 36.83,86.12
  Top 1.016: 34.27,86.12 36.83,86.12 v40.63,86.12 | v45.97,80.06 45.21,79.3 34.54,79.3
  Top 1.27: CI1.+ v94.49,38.61 | v45.97,80.06 CM4.+
  Top 2.032: Q1.4 v71.63,5.33
  Bottom 0.508: 45.72,84.07 45.97,84.07
  Bottom 1.016: v40.63,86.12 43.91,86.12 45.97,84.07
  Bottom 1.27: v94.49,38.61 96.01,38.61 | 45.97,84.07 v45.97,80.06
  Bottom 2.032: v71.63,5.33 73.41,3.56 86.61,3.56 96.01,12.95 96.01,38.61 96.01,68.32 94.49,69.84 87.13,69.84 85.85,71.12 D24V22F5.P$VIN 85.85,73.66 84.84,74.68 70.1,74.68 | 70.1,74.68 69.22,75.56 D24V50F5.P$VIN 69.22,82.17 67.31,84.07 45.97,84.07 | LINE_PWR.2 66.29,70.87 70.1,74.68
12V_RAW
  Bottom 0.508: 83.71,23.51 POWER.P$2
  Bottom 2.54: SWITCH.P$2 73.91,16.51 75.18,17.78 79.25,17.78 82.3,20.83 82.3,21.96 POWER2.P$2
  pour Bottom (isolate 0.508, no thermals): 84.58,26.92 89.92,25.4 94.49,25.4 94.49,19.81 80.01,19.81 80.01,26.42 80.52,26.92
A21_DAC0
  Top 0.508: TEENSY.A21 30.48,27.18 30.48,24.64 J1.1
A22_DAC1  (via drill 0.55)
  Top 0.508: RX3.1 RX1.1 RX2.2 51.17,51.17 v50.55,51.82 | v30.99,36.83 31.5,37.34 51.56,37.34 51.82,37.08 v52.07,37.08
  Bottom 0.508: v30.99,36.83 30.99,34.04 33.02,32 TEENSY.A22 | v52.07,37.08 52.07,46.48 50.29,48.26 50.29,51.56 v50.55,51.82
AGND  (via drill 0.55)
  Top 0.508: 30.11,67.82 RC2.1 | RVB2.1 CVB.2 | TEENSY.AGND 67.18,31.24 47.5,31.24 47.37,31.37
  Top 0.61: UC1.5 17.01,60.07 CC4.2 | UC2.5 30.21,59.82 CC6.2
  Top 0.762: RC2.1 CC1.2 | 30.11,67.82 CC7.2 30.11,64.38 v30.23,64.26 | CIR1.2 RIR4.1 v54.86,19.3 | 67.56,23.62 67.56,22.61 66.16,21.2 CIR2.2 RIR3.1 v62.48,19.3 | 67.56,23.62 67.56,28.83 TEENSY.AGND | LINE_DATA.1 3.81,45.47 v6.1,47.75 15.75,38.1 27.05,38.1 30.07,35.08 43.15,35.08 44.2,34.04 44.7,34.04 47.37,31.37 | CC4.2 v17.53,57.15 20.07,57.15 21.59,58.67 v29.21,58.67 30.11,58.67 CC6.2 | CC5.2 v18.03,65.53 | CVB.2 67.56,23.62
  Bottom 0.762: v54.86,19.3 v62.48,19.3 | v6.1,47.75 6.1,56.13 7.11,57.15 v17.53,57.15 17.53,65.02 v18.03,65.53 | v30.23,64.26 30.23,59.69 v29.21,58.67
AIN1  (via drill 0.55)
  Top 0.356: UM.21 30.38,84.17 29.98,84.57 | 29.98,84.57 29.97,84.58 29.98,84.57 | 29.98,84.57 v29.96,84.57
  Top 0.508: IC1.4 v38.35,60.2
  Bottom 0.508: v38.35,60.2 38.32,60.23 36.67,60.23 35.81,61.09 35.81,78.49 34.92,79.38 29.96,84.34 v29.96,84.57
BIN1  (via drill 0.55)
  Top 0.356: UM.17 34.8,81.58 35.05,81.83
  Top 0.508: v35.05,81.92 35.05,81.83 | IC1.8 44.73,54.86 v40.39,54.86
  Bottom 0.508: v40.39,54.86 40.39,59.31 40.39,60.71 40.39,60.96 39.62,61.72 37.98,61.72 37.37,62.33 37.37,79.6 v35.05,81.92
DISABLE2  (via drill 0.55)
  Top 0.356: UM.19 31.31,82.88 31.24,82.8
  Top 0.508: v27.94,82.04 28.7,82.8 31.24,82.8
  Bottom 0.508: TEENSY.27 25.4,72.64 25.65,72.9 25.65,73.91 25.4,74.17 25.4,81.28 26.16,82.04 v27.94,82.04
DIST1  (via drill 0.55)
  Top 0.508: RIR1.1 RIR4.2 CIR1.1 52.58,25.65 v52.83,25.91 | TEENSY.15/A1 v43.18,25.91
  Bottom 0.508: v52.83,25.91 v43.18,25.91
DIST2  (via drill 0.55)
  Top 0.508: CIR2.1 RIR3.2 RIR2.1 v59.94,24.64 | TEENSY.14/A0 v40.64,25.91
  Bottom 0.508: v59.94,24.64 41.66,24.64 40.64,25.65 v40.64,25.91
GND  (via drill 0.55, 1 pad 1.91)
  Top 0.356: UM.3 24.37,84.83 24.13,84.58 24.54,84.17 UM.4 | UM.9 27.28,80.92 27.43,80.77 | UM.10 25.57,80.26 27.18,80.26 | 34.29,82.55 34.11,82.22 UM.18 32.1,82.22 31.79,81.91 31.79,81.83 31.75,81.79
  other vias: 54.61,42.93 39.62,31.5 27.69,34.8 17.78,20.83 17.02,9.4 5.84,26.67 1.78,25.15 31.5,2.54 47.24,19.81 39.62,33.91 17.27,78.23 17.27,74.93 25.91,39.62 12.95,38.86 14.99,40.89 62.74,26.67 65.79,26.67 68.83,27.94 19.05,69.09 19.81,55.88 19.81,58.67 18.92,66.55 76.71,39.88 81.03,34.04 20.32,51.31 48.51,78.23 42.67,83.06 18.54,84.58 18.54,87.12 40.13,88.14 42.42,77.98 24.13,57.15 54.61,25.91 55.88,47.24 56.64,54.61 52.07,55.12 67.31,17.53 67.31,12.19 34.8,24.77 3.05,17.4 73.41,89.53 70.61,85.98 74.42,72.52 71.12,61.34 85.09,58.04 22.35,87.63 10.41,29.72 24.64,73.41 62.48,1.52 67.56,47.88 58.42,65.28 51.82,12.57 44.96,12.57 50.04,21.84 14.99,2.03 3.81,61.47 32,8.89
  pour Top: -1.27,97.79 -1.27,-1.27 100.33,-1.27 100.33,97.79
  pour Bottom (rank 2): -1.27,97.79 -1.27,-1.27 100.33,-1.27 100.33,97.79
LEFT_DIR  (via drill 0.55)
  Top 0.356: UM.22 31,84.83 30.22,85.6 v30.22,86.1
  Top 0.508: TEENSY.6 53.34,47.65 52.83,48.16 49.65,48.16 48.53,49.28 v41.4,49.28 | IC1.3 37.34,61.47 v37.08,61.21 v35.05,59.18
  Bottom 0.508: v37.08,61.21 36.58,61.72 36.58,74.17 36.58,78.99 30.95,84.62 30.95,84.98 30.22,85.71 v30.22,86.1 | v41.4,49.28 41.12,49.56 39.98,49.56 38.35,51.18 38.35,55.12 35.05,58.42 v35.05,59.18
LEFT_ENC_A  (via drill 0.55)
  Top 0.508: LEFT_MOTOR.5 34.41,93.84 CE3.1 34.41,89.8 v34.8,89.41 | v49.53,33.27 60.33,33.27 60.55,33.05 63.47,33.05 v63.5,33.02
  Bottom 0.508: v34.8,89.41 41.18,83.03 41.18,77.57 47.24,71.5 47.24,47.5 48.26,46.48 48.77,46.48 49.53,45.72 v49.53,33.27 | v63.5,33.02 TEENSY.23/A9
LEFT_ENC_B  (via drill 0.55)
  Top 0.508: LEFT_MOTOR.6 32.14,93.84 CE4.1 32.14,90.03 v32.77,89.41 | v46.99,34.32 60.68,34.32 v60.96,34.04
  Bottom 0.508: v32.77,89.41 40.47,81.71 40.47,77.28 46.48,71.26 46.48,65.79 46.48,46.48 46.99,45.97 v46.99,34.32 | v60.96,34.04 TEENSY.22/A8
LEFT_MOT_CURRENT  (via drill 0.55)
  Top 0.508: v31.24,72.64 31.76,73.16 RC4.2 33.52,73.16 34.16,72.52 UC_OP.1
  Bottom 0.508: TEENSY.16/A2 45.72,31.5 42.67,34.54 42.67,40.13 41.69,41.12 41.69,42.14 41.94,42.39 41.94,46.48 41.91,46.48 37.59,50.8 37.59,54.61 33.78,58.42 33.78,59.69 34.29,60.2 34.29,65.02 33.02,66.29 33.02,70.87 v31.24,72.64
LEFT_MOT_CURRENT_RAW  (via drill 0.55)
  Top 0.508: UC_OP.2 33.01,71.25 RC4.1 31.87,71.36 v31.37,70.87 | RC3.2 33.16,64.12 v33.15,64.14
  Bottom 0.508: v31.37,70.87 31.5,70.87 31.5,69.34 31.75,69.09 31.75,66.04 33.15,64.64 v33.15,64.14
LEFT_MOTOR_+  (via drill 0.55)
  Top 0.61: UC2.3 21.72,61.09 v21.08,60.45 21.72,59.82 UC2.4
  Bottom 1.016: LEFT_MOTOR.1 44.7,92.96 43.94,92.2 22.61,92.2 20.07,89.66 20.07,83.18 22.07,81.18 22.07,65.76 19.81,63.5 19.81,61.21 20.57,60.45 v21.08,60.45
LEFT_MOTOR_-  (via drill 0.55)
  Top 0.356: UM.2 24.25,85.47 24.13,85.6 | 24.13,85.8 24.13,85.6 | UM.1 24.15,86.12 24.13,85.6
  Top 1.016: LEFT_MOTOR.2 42.16,91.44 v42.16,90.93 | v24.13,87.63 24.13,85.8
  Bottom 1.016: v42.16,90.93 24.89,90.93 24.13,90.17 v24.13,87.63
LEFT_MOTOR_OUT  (via drill 0.55)
  Top 0.356: UM.6 24.06,82.88 24.13,83.06 24.13,83.21 24.17,83.53 UM.5
  Top 0.61: UC2.1 21.72,63.63 v21.08,62.99 21.72,62.36 UC2.2
  Top 1.016: v22.61,83.21 24.13,83.21
  Bottom 1.016: v21.08,62.99 23.37,65.28 23.37,82.04 23.37,82.45 v22.61,83.21
LEFT_PWM  (via drill 0.55)
  Top 0.508: TEENSY.3 60.96,48.77 60.15,49.58 50.25,49.58 48.52,51.31 48.51,51.31 47.75,52.07 v41.4,52.07 | IC1.1 40.11,64.49 v40.89,65.28
  Bottom 0.508: v41.4,52.07 41.4,64.77 v40.89,65.28
LINE_LED_LOW  (via drill 0.55)
  Top 0.508: v32,39.37 38.99,39.37 39.72,40.1 40.54,40.1 41.12,39.52 59.86,39.52 60.41,38.97 62.33,38.97 62.88,39.52 65.43,39.52 v65.53,39.62
  Bottom 0.508: TEENSY.25 32,43.56 v32,39.37 | v65.53,39.62 69.85,43.94 69.83,43.97 69.83,45.6 69.6,45.83 69.6,61.98 71.37,63.75 73.15,65.53 73.15,68.83 71.88,70.1 69.85,70.1 68.83,69.09 LINE_PWR.4
LS0  (via drill 0.55)
  Top 0.508: v8.13,50.55 2.29,50.55 1.52,49.78 1.52,41.4 2.29,40.64 LINE_DATA.3
  Bottom 0.508: TEENSY.31/A12 15.24,49.53 14.22,50.55 v8.13,50.55
LS1
  Bottom 0.508: LINE_DATA.4 8.26,40.64 TEENSY.32/A13
LS2
  Bottom 0.508: LINE_DATA.9 5.33,31.5 7.87,31.5 8.38,32 24.89,32 25.4,31.5 TEENSY.38/A19
LS3  (via drill 0.55)
  Top 0.508: TEENSY.34/A15 15.24,28.7 14.48,27.94 v10.67,27.94
  Bottom 0.508: v10.67,27.94 3.89,27.94 2.36,29.46 2.36,37.8 2.67,38.1 LINE_DATA.5
LS4  (via drill 0.55)
  Top 0.508: TEENSY.35/A16 v17.78,35.05
  Bottom 0.508: LINE_DATA.6 9.4,35.05 v17.78,35.05
LS5
  Bottom 0.508: LINE_DATA.10 27.43,33.02 27.94,32.51 TEENSY.39/A20
LS6  (via drill 0.55)
  Top 0.508: v4.83,28.96 4.06,28.96 2.29,30.73 2.29,35.05 2.79,35.56 LINE_DATA.7
  Bottom 0.508: TEENSY.36/A17 20.32,30.73 19.81,31.24 8.89,31.24 6.6,28.96 v4.83,28.96
LS7  (via drill 0.55)
  Top 0.508: TEENSY.37/A18 v22.86,34.04
  Bottom 0.508: v22.86,34.04 9.14,34.04 7.62,35.56 LINE_DATA.8
MISO&LINE_LED_HIGH  (via drill 0.55)
  Top 0.508: v40.13,39.09 40.41,38.81 59.36,38.81 60.07,38.1 62.99,38.1 v63.25,38.35
  Bottom 0.508: SPI.6 28.96,50.29 29.52,49.73 30.8,49.73 32.78,47.75 35.43,47.75 TEENSY.12 38.1,43.55 39.83,41.82 39.83,39.42 40.13,39.12 v40.13,39.09 | v63.25,38.35 64.55,39.65 64.55,40.03 67.33,42.82 67.33,45.6 68.83,47.1 LINE_PWR.3
MOSI&STATUS_LED  (via drill 0.55)
  Top 0.508: RL1.2 v55.88,8.38 | v50.04,8.89 50.04,18.8 v49.78,19.05 | v45.47,23.46 45.47,28.34 44.48,29.33 44.48,30.71 43.69,31.5 v43.18,31.5
  Bottom 0.508: SPI.4 31.5,50.55 32.26,49.78 36.07,49.78 40.64,45.21 TEENSY.11 40.64,39.97 41.12,39.49 41.12,33.56 v43.18,31.5 | v55.88,8.38 50.55,8.38 v50.04,8.89 | v49.78,19.05 45.47,23.37 v45.47,23.46
N$1
  Top 0.508: BUZZER.1 28.96,19.81 RBZ1.2
N$2
  Top 0.508: RBZ1.1 27.12,24.78 QBZ.3
N$3
  Top 0.508: LED_STATUS.A 57.91,6.6 58.81,7.5 RL1.1
N$4
  Top 0.508: RL2.1 51.93,5.96 LED_PWR.A
N$5
  Top 0.508: RQ1.2 76.45,7.61
  Top 0.762: 79.26,8.13 78.75,7.61
  Top 1.016: DP.C 79.26,8.13
  Top 2.032: Q1.3 75.18,7.61 76.45,7.61 78.75,7.61 80.64,5.71 MAIN_FUSE.PIN1
N$6  (via drill 1 pad 1.91)
  Top 2.54: v87.12,8.64 87.12,3.66 MAIN_FUSE.PIN2
  Bottom 2.54: SWITCH.P$1 81.79,13.97 v87.12,8.64
N$7  (via drill 0.55)
  Top 0.508: Q1.1 75.7,3.05 76.45,3.81 RQ1.1 | PWR.4 38.8,15.04 Q2.8 37.21,17.14 37.08,17.27 37.08,18.29 37.21,18.41 Q2.7 40.01,18.41 40.64,19.05 40.64,22.43 CQ2A.1
  Top 0.559: v75.69,1.52 75.69,3.05 75.7,3.05
  Bottom 0.508: v75.69,1.52 68.95,1.52 59.04,11.43 PWR.3 PWR.4
N$8
  Top 0.508: RM.1 CM3.1
N$9
  Top 0.508: UC1.6 17.52,61.34 CC4.1
N$10
  Top 0.508: UC2.6 30.72,61.09 CC6.1
N$11
  Top 0.508: UC1.7 16.38,62.61 16.76,62.99 RC5.1
N$16
  Top 0.508: RC1.1 29.84,70.74 30.23,70.36 RC2.2 CC1.1 33.01,69.98 UC_OP.3 37.47,69.98 38.73,68.71 UC_OP.5
N$17
  Top 0.508: UC2.7 31.23,62.36 RC3.1
N$18  (via drill 0.55)
  Top 0.508: IR.1 IR.4 | Q2.5 36.96,20.95 v36.32,20.32 36.96,19.68 Q2.6
  Bottom 0.508: v36.32,20.32 36.32,16.76 35.81,16.26 34.29,16.26 33.53,15.49 33.53,14.48 34.29,13.72 IR.1
N$19
  Top 0.508: RS1.2 57.01,93.61 SERVO1.3
N$20
  Top 0.508: RIR1.2 57.4,19.81 54.36,16.76 54.36,12.95 55.12,12.19 57.91,12.19 58.67,12.95 IR.3
N$21
  Top 0.508: RIR2.2 59.94,19.81 61.21,18.54 IR.6
N$22
  Top 0.508: SERVO2.3 57.54,87.51 RS2.2
N$23
  Top 0.508: SERVO3.3 58.05,81.42 RS3.2
N$24
  Top 0.508: RS4.2 58.54,75.32 56.9,73.68 SERVO4.3
N$25
  Top 0.508: RS5.2 58.54,69.23 56.9,67.59 SERVO5.3
N$26
  Top 0.508: RX1.2 54.61,56.13 X-ADC.3
PWM1  (via drill 0.55)
  Top 0.508: RS1.1 v59.69,88.9 | v63.5,86.87 65.28,85.09 v65.28,73.66 | TEENSY.5 55.88,42.67 56.13,42.42 64.52,42.42 64.8,42.7 64.8,45.6 66.04,46.84 v66.04,47.75
  Bottom 0.508: v59.69,88.9 61.47,88.9 v63.5,86.87 | v65.28,73.66 64.01,72.39 64.01,57.66 64.77,56.9 64.77,48.77 65.79,47.75 v66.04,47.75
PWM2  (via drill 0.55)
  Top 0.508: v45.72,41.93 45.99,41.66 61.47,41.66 64.2,41.66 v64.42,41.43 | RS2.1 59.69,84.84 v62.48,82.04
  Bottom 0.508: TEENSY.9 v45.72,41.93 | v45.72,41.93 45.72,41.91 v45.72,41.93 | v62.48,82.04 62.74,82.04 65.28,79.5 65.28,75.69 63.25,73.66 63.25,57.66 63.3,57.61 63.3,57.36 64.01,56.65 64.01,48.52 64.77,47.76 64.77,41.66 64.64,41.66 v64.42,41.43
PWM3  (via drill 0.55)
  Top 0.508: v42.67,41.73 43.45,40.95 60.45,40.95 60.73,40.67 v61.47,40.67 | RS3.1 v59.69,78.23 | v63.25,47.5 62.23,46.48 62.23,43.94 61.72,43.43 v61.47,43.43
  Bottom 0.508: TEENSY.10 42.67,44.58 42.67,44.07 42.67,42.16 42.67,41.66 v42.67,41.73 | v59.69,78.23 62.48,75.44 62.48,48.26 v63.25,47.5 | v61.47,40.67 v61.47,43.43
PWM4  (via drill 0.55)
  Top 0.508: TEENSY.29 v20.32,41.91 | v27.94,40.89 32,40.89 32.77,40.13 38.75,40.13 39.43,40.81 40.84,40.81 41.41,40.23 60.16,40.23 60.71,39.68 62.04,39.68 v62.99,40.64 | RS4.1 v59.69,72.14
  Bottom 0.508: v20.32,41.91 22.1,41.91 22.86,41.15 27.94,41.15 v27.94,40.89 | v59.69,72.14 61.72,70.1 61.72,47.24 62.26,46.71 62.26,44.57 62.74,44.09 62.74,40.89 v62.99,40.64
PWM5  (via drill 0.55)
  Top 0.508: v29.21,31.5 29.21,28.7 27.18,26.67 25.64,26.67 QBZ.1 24.76,25.79 RBZ2.2 | v28.7,38.1 58.93,38.1 59.18,37.85 v59.18,37.59 | RS5.1 v59.69,66.04
  Bottom 0.508: v29.21,31.5 29.21,38.1 | 29.21,38.1 29.21,41.66 28.7,42.16 23.11,42.16 22.1,43.18 18.8,43.18 17.78,44.2 TEENSY.30 | 29.21,38.1 v28.7,38.1 | v59.69,66.04 60.96,64.77 60.96,47.24 59.66,45.95 59.66,37.97 59.44,37.74 v59.18,37.59
PWMA  (via drill 0.55)
  Top 0.356: UM.23 31.63,85.47
  Top 0.508: 31.63,85.47 31.25,85.85 v31.24,86.87 | v38.35,62.74 IC1.2
  Bottom 0.508: v31.24,86.87 31.75,86.87 32.74,85.87 32.74,85.85 38.33,80.26 38.33,72.67 40.39,70.61 40.39,66.17 39.91,65.69 39.91,63.02 39.62,62.74 v38.35,62.74
PWMB  (via drill 0.55)
  Top 0.356: UM.15 v31.24,80.28
  Top 0.508: v38.1,57.91 38.35,57.66 IC1.6
  Bottom 0.508: v31.24,80.28 33.01,80.28 35.05,78.23 35.05,72.39 35.05,60.85 36.38,59.52 37.51,59.52 38.1,58.93 v38.1,57.91
PWR_IR  (via drill 0.55)
  Top 0.508: v35.81,32.77 39.88,32.77 41.91,30.73 41.91,23.05 Q2.4 45.96,20.95 RIR5.2
  Bottom 0.508: v35.81,32.77 33.02,35.56 TEENSY.24
PWR_ROBOT  (via drill 0.55)
  Top 0.508: v31.75,25.65 v31.75,31.5 | RQ2A.2 46.24,18.43 | 46.24,18.43 v46.23,18.41 | Q2.2 45.21,18.41 46.24,18.43
  Bottom 0.508: v31.75,25.65 32,25.91 38.61,25.91 45.09,19.43 v46.23,18.41 | TEENSY.28 22.86,43.69 23.37,43.18 29.21,43.18 29.97,42.42 29.97,33.27 v31.75,31.5
RIGHT_DIR  (via drill 0.55)
  Top 0.356: 36.02,80.92 UM.16
  Top 0.508: TEENSY.2 63.5,46.36 64.23,47.09 64.23,47.91 61.85,50.29 50.55,50.29 49.28,51.56 49.28,52.83 50.04,53.59 v50.55,53.59 | v50.55,57.66 IC1.9 | v43.69,81.03 43.53,80.92 36.02,80.92
  Bottom 0.508: v50.55,53.59 v50.55,57.66 50.55,57.91 50.23,58.23 50.23,74.12 48.67,75.68 44.71,75.68 43.69,76.71 v43.69,81.03
RIGHT_ENC_A  (via drill 0.55)
  Top 0.508: RIGHT_MOTOR.5 24.27,93.84 CE1.1 24.27,90.79 25.4,89.66 v25.65,89.66 | v44.7,35.31 v55.12,35.31
  Bottom 0.508: v25.65,89.66 26.92,88.39 31.24,88.39 39.04,80.59 39.04,76.69 44.45,71.28 44.45,44.45 44.7,44.2 44.7,42.42 44.7,41.91 v44.7,35.31 | v55.12,35.31 55.88,34.54 TEENSY.20/A6
RIGHT_ENC_B  (via drill 0.55)
  Top 0.508: RIGHT_MOTOR.6 26.53,93.84 CE2.1 26.53,90.31 v27.43,89.41 | v58.42,32.26 48.51,32.26 v48.01,32.77 | v48.26,43.18 48.26,43.33 47.02,44.57 47.02,46.2 v45.47,47.75
  Bottom 0.508: v27.43,89.41 27.69,89.15 31.62,89.15 32.61,88.17 32.74,88.17 39.76,81.15 39.76,76.98 45.47,71.27 v45.47,47.75 | TEENSY.21/A7 v58.42,32.26 | v48.01,32.77 48.01,42.67 48.26,42.93 v48.26,43.18
RIGHT_MOT_CURRENT  (via drill 0.55)
  Top 0.508: UC_OP.7 41.91,71.25 | 41.91,71.25 42.17,71.25 RC6.2 | 41.91,71.25 v41.91,71.88 | v43.18,47.24 44.45,45.97 44.45,44.2 43.72,43.46 v43.72,43.43
  Bottom 0.508: v41.91,71.88 43.43,70.36 43.43,47.5 v43.18,47.24 | v43.72,43.43 43.72,35.97 43.46,35.72 43.46,34.9 46.58,31.78 47.72,31.78 48.26,31.24 TEENSY.17/A3
RIGHT_MOT_CURRENT_RAW  (via drill 0.55)
  Top 0.508: 42.91,68.71 RC6.1 | RC5.2 19.19,64.91 v20.07,65.79 | v20.57,69.85 21.08,70.36 v28.7,70.36 | RC6.1 42.56,68.7 41.27,69.98 UC_OP.6 38.73,69.98 37.59,71.12 37.59,73.41 36.83,74.17 31.34,74.17 v31.24,74.07 | 42.53,68.7 RC6.1
  Bottom 0.508: v20.07,65.79 20.57,66.29 v20.57,69.85 | v28.7,70.36 30.23,71.88 30.23,73.66 30.64,74.07 v31.24,74.07
RIGHT_MOTOR_+  (via drill 0.55)
  Top 0.61: UC1.4 8.26,60.07 7.87,60.45 v7.87,60.71 8.51,61.34 UC1.3
  Bottom 1.016: RIGHT_MOTOR.1 13.97,83.57 11.43,81.03 11.43,69.34 6.1,64.01 6.1,61.72 7.11,60.71 v7.87,60.71
RIGHT_MOTOR_-  (via drill 0.55)
  Top 0.356: UM.12 24.26,78.97 24.26,79.12 24.26,79.3 24.26,79.38 24.26,79.62 UM.11
  Top 1.016: v20.07,79.5 20.27,79.3 24.26,79.3
  Bottom 1.016: v20.07,79.5 16.51,83.06 RIGHT_MOTOR.2
RIGHT_MOTOR_OUT  (via drill 0.55)
  Top 0.356: UM.8 24.09,81.58 24.13,81.89 24.2,82.22 UM.7
  Top 0.61: UC1.2 8.51,62.61 v7.87,63.25 8.51,63.88 UC1.1
  Top 1.016: v14.99,81.89 24.13,81.89
  Bottom 1.016: v14.99,81.89 12.95,79.86 12.95,68.33 v7.87,63.25
RIGHT_PWM  (via drill 0.55)
  Top 0.508: TEENSY.4 58.42,48.36 57.91,48.87 49.95,48.87 48.27,50.55 v40.39,50.55 | IC1.5 37.34,58.93 v36.83,58.42
  Bottom 0.508: v36.83,58.42 36.83,57.66 39.12,55.37 39.12,51.82 v40.39,50.55
RX  (via drill 0.55)
  Top 0.508: v80.52,59.94 v85.09,59.94 85.34,59.94 | TEENSY.0 68.58,42.67 69.09,42.16 v71.63,42.16
  Bottom 0.508: v85.09,59.94 87.72,59.94 92.11,64.34 92.11,65.69 93.49,67.07 ESP8266.TX | v71.63,42.16 79.5,42.16 80.01,42.67 80.01,59.44 v80.52,59.94
RX3  (via drill 0.55)
  Top 0.508: SERIAL.3 2.29,81.28 1.78,80.77 1.78,77.72 3.3,76.2 41.41,76.2 44.16,73.46 49.2,73.46 v49.25,73.41
  Bottom 0.508: TEENSY.7 50.8,46.48 49.28,48.01 49.28,48.13 49.28,73.38 v49.25,73.41
SCK&BUILTIN_LED
  Bottom 0.508: SPI.3 31.5,55.12 30.99,55.63 28.19,55.63 27.18,54.61 27.18,50.55 28.96,48.77 30.23,48.77 32.26,46.74 33.27,46.74 34.31,45.7 34.31,44.57 38.1,40.78 38.1,39.12 TEENSY.13
SCL  (via drill 0.55)
  Top 0.508: IMU.4 8.13,10.67 9.4,9.4 14.73,9.4 16.51,11.18 v16.51,14.73 | I2C.4 8.13,19.81 8.89,19.05 v16.51,19.05
  Bottom 0.508: v16.51,14.73 v16.51,19.05 16.51,25.65 17.78,26.92 52.07,26.92 53.34,28.19 TEENSY.19/A5
SDA  (via drill 0.55)
  Top 0.508: IMU.3 8.13,15.49 8.64,16 v14.48,16 | I2C.3 8.13,24.64 9.65,26.16 v15.49,26.16
  Bottom 0.508: v14.48,16 14.48,25.15 v15.49,26.16 17.27,27.94 49.78,27.94 50.8,28.96 TEENSY.18/A4
START  (via drill 0.55)
  Top 0.508: START.1 28.96,8.83 28.96,12.95 31.61,15.61 CST.1 31.61,16.88 33.39,18.66 RST.2 33.39,27.8 34.29,28.7 v34.29,31.5
  Bottom 0.508: START.2 START.1 | v34.29,31.5 34.29,32.77 32.26,34.8 32.26,37.08 30.99,38.35 30.99,42.67 28.57,45.09 TEENSY.26
TX  (via drill 0.55)
  Top 0.508: v80.52,61.47 85.09,61.47 85.87,62.24 ESP8266.RX | TEENSY.1 66.04,41.91 67.56,40.39 v69.34,40.39
  Bottom 0.508: v69.34,40.39 69.34,41.91 70.87,43.43 78.74,43.43 79.25,43.94 79.25,60.2 v80.52,61.47
TX3  (via drill 0.55)
  Top 0.508: SERIAL.4 8.89,81.28 13.21,76.96 41.91,76.96 44.45,74.42 48.01,74.42 v48.26,74.7 | v48.26,48.01 TEENSY.8
  Bottom 0.508: v48.26,74.7 48.26,51.31 v48.26,48.01
V_BAT  (via drill 0.55)
  Top 0.508: CVB.1 RVB2.2 70.24,19.17 v70.87,18.54 | v64.01,9.65 62.85,9.65 RVB1.1 61.84,8.64 60.71,8.64 60.2,8.13 v60.2,7.87
  Bottom 0.508: v64.01,9.65 64.01,11.68 v70.87,18.54 | TEENSY.33/A14 12.7,13.72 13.21,13.21 32.51,13.21 33.27,12.45 33.27,2.54 34.04,1.78 59.18,1.78 60.2,2.79 v60.2,7.87

### Text on the board
tPlace: GND | 5VS | PWM | 5VS | < | RED | (5V SERVO) | RED> | SERVO1 | GND | GND | + | - | - | + | 3V3 | SERVO2 | SERVO3 | ---> | SERVO / GND-5VS-PWM / BLACK-RED-YELLOW | SERVO4 | (MCP6242) | SERVO5 | EXTRA | (ACS712) | (ACS712) | 5V | (INVERTER) | GND | GND | 5V | REGBOT / v4.1 / 2018 | TEENSY 3.5 | GND | GND | MAX 13.5V | POWER | GND | 12VR | -> | DTU AUTOMATION AND CONTROL | <- | <- | BUZZER | A21& / DAC0 | (DMN2029) | GND | POWER SWITCH | 12VR | ° | PRESS TO START | HOLD TO PROGRAM | UP / = / ON | FUSE | GND | REGBOT / v4.1 | START | POWER ON | (PMOS) | T
bPlace: 5VS | GND | 5VS | PWM | GND | 5V | RIGHT / ENC A | RIGHT / ENC B | LEFT / ENC B | LEFT / ENC A | 5V | GND | RIGHT / MOTOR + | RIGHT / MOTOR - | LEFT / MOTOR + | LEFT / MOTOR - | GND | 5VS | PWM | 3V3 | GND | GND | 3V3 | GND | 5VS | PWM | RX3 | TX3 | 5V | NC | NC | 12V | GND | GND | 5VS | GND | 5VS | PWM | NC | NC | 12V | GND | 5V | GND | 5VS | PWM | LED / LOW | 12V | NC | 3V3 | 3V3 | 3V3 | RX | GND | NC | LED / HIGH | TX | NC | NC | GND | GND | 5VS | X-A | 5V | NC | SCK | GND | GND | MISO | MOSI | 5V | AGND | 5V | LS0 | LS1 | LS3 | LS4 | LS6 | LS7 | GND | LS2 | LS5 | GND | GND | 12VR | 5V | SDA | GND | 12VR | -> | BZZ | GND | GND | 5V | A21& / DAC0 | NC | SCL | 3V3 | 5V | SGND | DIST2 | 5V | SDA | GND | SGND | DIST1 | 5V | NC | SCL | 3V3 | GND | B